# Altium schematic sheet LCD-MEM-TEMP.SchDoc
size A4
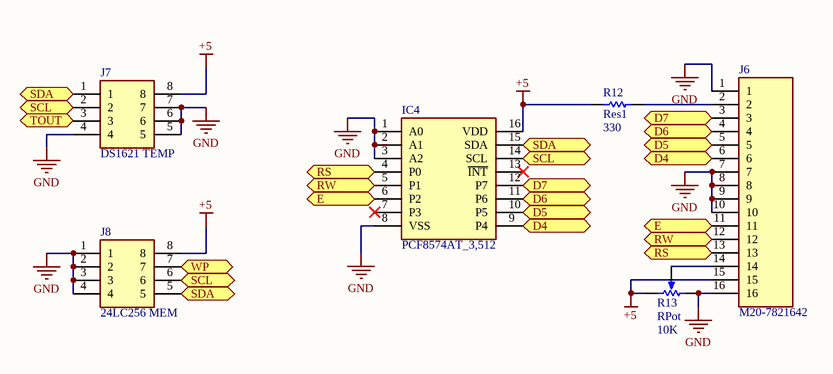
[diagram p0: LCD-MEM-TEMP.SchDoc]

## Parts
IC4  PCF8574AT_3,512  [I2C LCD IC]
J6  M20-7821642  [Header 16 pins fem.]
J7  DS1621 TEMP  [DIL 8 pins]
J8  24LC256 MEM  [DIL 8 pins]
R12  Res1  value 330  [Resistor 1210]
R13  RPot  value 10K  [POT]

## Ports
D4 (bidir), D5 (bidir), D6 (bidir), D7 (bidir), E (bidir), RS (bidir), RW (bidir), SCL (bidir), SDA (bidir), TOUT (bidir), WP (bidir)

## Nets
+5: IC4.16(VDD) J6.15 J7.8 J8.8 R12.1 R13.2(BOT)
GND: IC4.1(A0) IC4.2(A1) IC4.3(A2) IC4.8(VSS) J6.1 J6.7 J6.8 J6.9 J6.10 J6.16 J7.4 J7.5 J7.6 J7.7 J8.1 J8.2 J8.3 J8.4 R13.1(TOP)
D4: IC4.9(P4) J6.6 ; port D4
D5: IC4.10(P5) J6.5 ; port D5
D6: IC4.11(P6) J6.4 ; port D6
D7: IC4.12(P7) J6.3 ; port D7
E: IC4.6(P2) J6.11 ; port E
RS: IC4.4(P0) J6.13 ; port RS
RW: IC4.5(P1) J6.12 ; port RW
SCL: IC4.14(SCL) J7.2 J8.6 ; port SCL
SDA: IC4.15(SDA) J7.1 J8.5 ; port SDA
WP: J8.7 ; port WP
NetJ6_2: J6.2 R12.2
NetJ6_14: J6.14 R13.3(TAP)

Not connected (* = marked no-connect by the designer): IC4 7(P3)* 13(~{INT})*; J7 3

## Library data of the parts
IC4 = PCF8574AT_3,512: Integrated Circuit; Manufacturer_Name: Nexperia; Manufacturer_Part_Number: PCF8574AT/3,512; Datasheet Link: https://www.nxp.com/docs/en/data-sheet/PCF8574_PCF8574A.pdf; Height: 2.65mm; Arrow Part Number: PCF8574AT/3,512; Arrow Price/Stock: https://www.arrow.com/en/products/pcf8574at3512/nxp-semiconductors; Mouser Part Number: 771-PCF85AT3512; Mouser Price/Stock: https://www.mouser.com/Search/Refine.aspx?Keyword=771-PCF85AT3512
J6 = M20-7821642: Connector; Manufacturer_Name: Harwin; Datasheet Link: https://componentsearchengine.com//M20-7821642.pdf; Height: 8.65mm; Mouser2 Part Number: 855-M20-7821642; Mouser2 Price/Stock: https://www.mouser.com/Search/Refine.aspx?Keyword=855-M20-7821642; Manufacturer_Part_Number: M20-7821642
J7 J8 = 110-41-308-41-001000: Connector; Manufacturer_Name: Mill-Max; Datasheet Link: https://www.arrow.com/en/products/110-41-308-41-001000/mill-max; Height: 4.19mm; Manufacturer_Part_Number: 110-41-308-41-001000
R12 = Res1: Resistor; Published: 8-Jun-2000; LatestRevisionDate: 17-Jul-2002; LatestRevisionNote: Re-released for DXP Platform.; PackageReference: AXIAL-0.3; Publisher: Altium Limited; PackageDescription: Axial Device, Thru-Hole; 2 Leads; 0.3 in Pin Spacing
R13 = RPot: Potentiometer; Sim Note: Enter the Resistance value and the set point into parameter fields.; Set Position: 0.5; Published: 8-Jun-2000; LatestRevisionDate: 17-Jul-2002; LatestRevisionNote: Re-released for DXP Platform.; PackageReference: VR5; Publisher: Altium Limited; PackageDescription: Variable Resistor, Thru-Hole; 3 Leads